# EAGLE schematic MainCircuitSchematic (EAGLE 9.6.2)
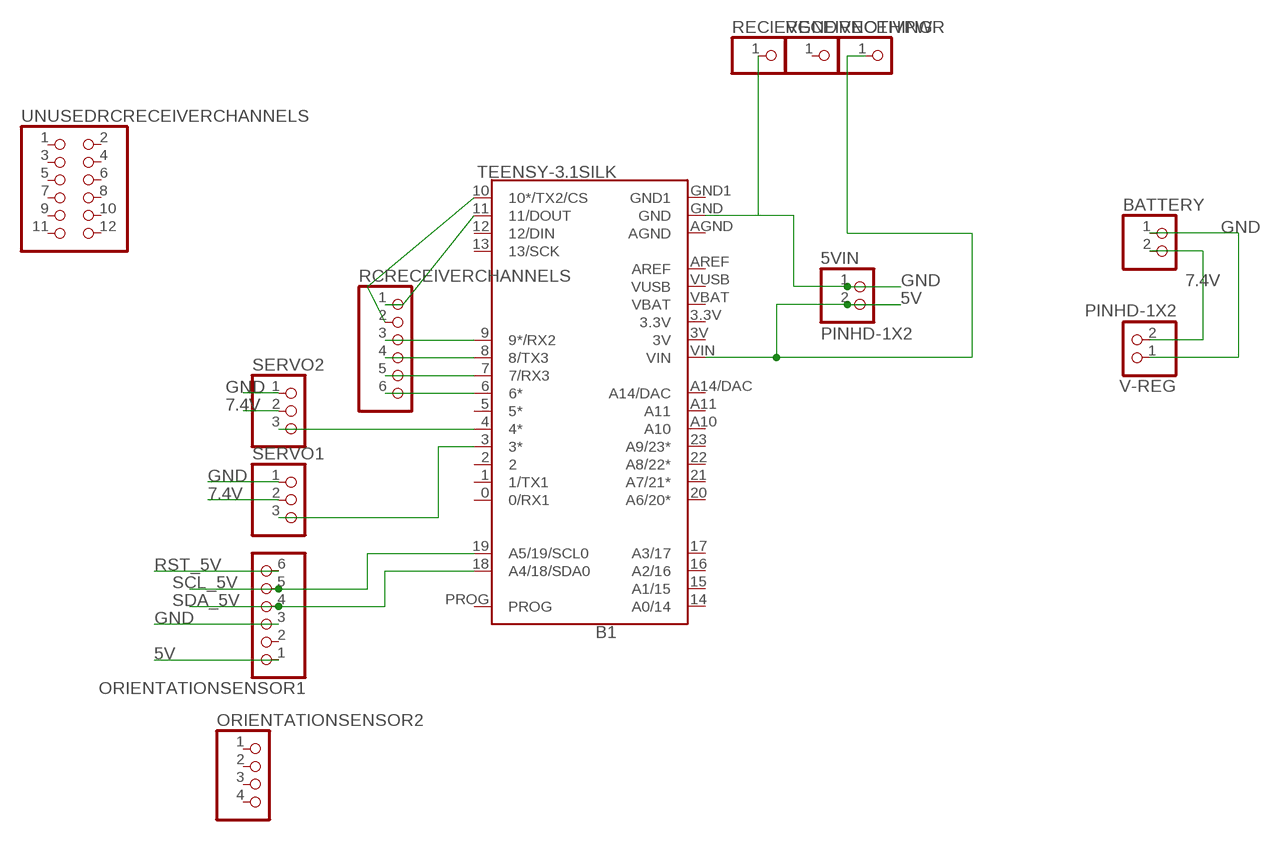
[diagram p0: schematic, sheet 1]

## Parts
5VIN  PINHD-1X2  [1X02]
B1  TEENSY-3.1SILK  [TEENSY-3.1]
BATTERY  PINHD-1X2  [1X02]
ORIENTATIONSENSOR1  HEADER-1X676MIL  [1X06_ROUND_76]
ORIENTATIONSENSOR2  HEADER-1X476MIL  [1X04_ROUND_76]
RCRECEIVERCHANNELS  PINHD-1X6  [1X06]
RECEIVNOTHING  PINHD-1X1  [1X01]
RECEIVPWR  PINHD-1X1  [1X01]
RECIEVGND  PINHD-1X1  [1X01]
SERVO1  PINHD-1X3CB  [1X03-CLEANBIG]
SERVO2  PINHD-1X3CB  [1X03-CLEANBIG]
UNUSEDRCRECEIVERCHANNELS  PINHD-2X6  [2X06]
V-REG  PINHD-1X2  [1X02]

## Nets
5V: 5VIN.2 B1.VIN ORIENTATIONSENSOR1.1 RECEIVPWR.1
7.4V: BATTERY.2 SERVO1.2 SERVO2.2 V-REG.2
GND: 5VIN.1 B1.GND BATTERY.1 ORIENTATIONSENSOR1.3 RECIEVGND.1 SERVO1.1 SERVO2.1 V-REG.1
N$1: B1.11(11/DOUT) RCRECEIVERCHANNELS.1
N$2: B1.10(10*/TX2/CS) RCRECEIVERCHANNELS.2
N$3: B1.9(9*/RX2) RCRECEIVERCHANNELS.3
N$4: B1.8(8/TX3) RCRECEIVERCHANNELS.4
N$5: B1.7(7/RX3) RCRECEIVERCHANNELS.5
N$6: B1.6(6*) RCRECEIVERCHANNELS.6
N$7: B1.4(4*) SERVO2.3
N$8: B1.3(3*) SERVO1.3
RST_5V: ORIENTATIONSENSOR1.6
SCL_5V: B1.19(A5/19/SCL0) ORIENTATIONSENSOR1.5
SDA_5V: B1.18(A4/18/SDA0) ORIENTATIONSENSOR1.4
Unconnected: B1.0(0/RX1) B1.1(1/TX1) B1.2 B1.5(5*) B1.12(12/DIN) B1.13(13/SCK) B1.14(A0/14) B1.15(A1/15) B1.16(A2/16) B1.17(A3/17) B1.20(A6/20*) B1.21(A7/21*) B1.22(A8/22*) B1.23(A9/23*) B1.A10 B1.A11 B1.A14/DAC B1.AREF B1.PROG ORIENTATIONSENSOR1.2 ORIENTATIONSENSOR2.1 ORIENTATIONSENSOR2.2 ORIENTATIONSENSOR2.3 ORIENTATIONSENSOR2.4 RECEIVNOTHING.1 UNUSEDRCRECEIVERCHANNELS.1 UNUSEDRCRECEIVERCHANNELS.2 UNUSEDRCRECEIVERCHANNELS.3 UNUSEDRCRECEIVERCHANNELS.4 UNUSEDRCRECEIVERCHANNELS.5 UNUSEDRCRECEIVERCHANNELS.6 UNUSEDRCRECEIVERCHANNELS.7 UNUSEDRCRECEIVERCHANNELS.8 UNUSEDRCRECEIVERCHANNELS.9 UNUSEDRCRECEIVERCHANNELS.10 UNUSEDRCRECEIVERCHANNELS.11 UNUSEDRCRECEIVERCHANNELS.12

## Power pins joined to a net without a drawn wire
3.3V: B1.3.3V
3V: B1.3V
AGND: B1.AGND
GND1: B1.GND1
VBAT: B1.VBAT
VUSB: B1.VUSB

## Library data of the parts
5VIN BATTERY V-REG = Connector:PINHD-1X2: PIN HEADER; CATEGORY: CONNECTOR; SUB-CATEGORY: PIN-HEADER
B1 = SparkFun-Boards:TEENSY-3.1: Teensy 3+ Footprint Mechanical footprint with connectors for Teensy Development Board with ARM Cortex. SparkFun Products: Teensy 3.2 <https://www.sparkfun.com/products/13736> Teensy LC <https://www.sparkfun.com/products/13305>; SF_ID: DEV-12646
ORIENTATIONSENSOR1 = microbuilder:HEADER-1X6: PIN HEADER
ORIENTATIONSENSOR2 = microbuilder:HEADER-1X4: PIN HEADER
RCRECEIVERCHANNELS = adafruit:PINHD-1X6: PIN HEADER
RECEIVNOTHING RECEIVPWR RECIEVGND = pinhead:PINHD-1X1: PIN HEADER
SERVO1 SERVO2 = adafruit:PINHD-1X3: PIN HEADER
UNUSEDRCRECEIVERCHANNELS = Connector:PINHD-2X6: PIN HEADER; CATEGORY: CONNECTOR; SUB-CATEGORY: PIN-HEADER